# EAGLE design RACOON (EAGLE 9.4.2)
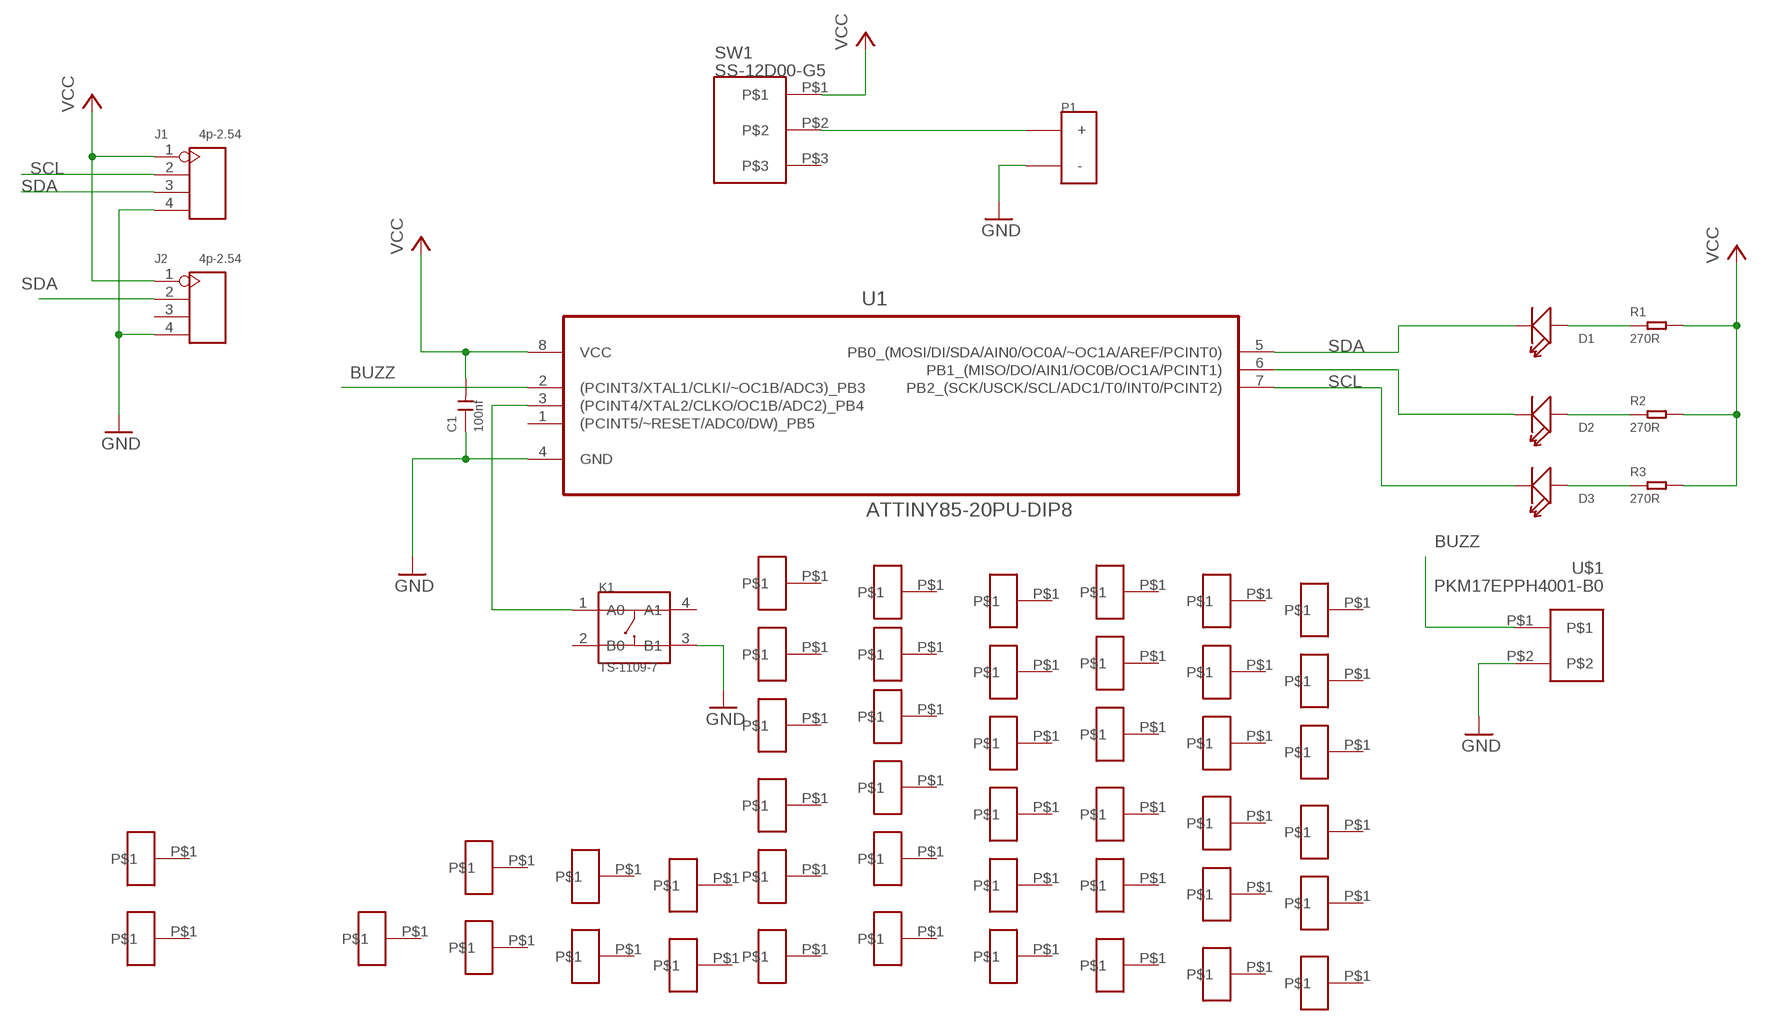
[diagram p0: schematic, sheet 1]

## Parts
C1  100nf  DIP-CERAMIC-DISC-100NF-50V-Y5V(D5.0MM)  [CERAMIC-2.54]
D1  504BW  DIP-LED-BLUE-BLUE(2P-D5MM)  [LED2-2.54-D5.0MM]
D2  504BW  DIP-LED-BLUE-BLUE(2P-D5MM)  [LED2-2.54-D5.0MM]
D3  504BW  DIP-LED-BLUE-BLUE(2P-D5MM)  [LED2-2.54-D5.0MM]
J1  4p-2.54  DIP-BLACK-FEMALE-HEADER-VERT(4P-2.54)  [H4-2.54]
J2  4p-2.54  DIP-BLACK-FEMALE-HEADER-VERT(4P-2.54)  [H4-2.54]
K1  TS-1109-7  DIP-BUTTON-TOP-BLACK(4P-D6.2MM)  [SW4-6.2X6.2X5.0MM]
P1  BATTERY  [BAT_CR2450_TH_BS2450]
R1  270R  DIP-RES-270R-5%-1/4W(PR-D2.3XL6.5MM)  [PR-D2.3XL6.5MM]
R2  270R  DIP-RES-270R-5%-1/4W(PR-D2.3XL6.5MM)  [PR-D2.3XL6.5MM]
R3  270R  DIP-RES-270R-5%-1/4W(PR-D2.3XL6.5MM)  [PR-D2.3XL6.5MM]
SW1  SS-12D00-G5  [SS-12D00-G5]
U1  ATTINY85-20PU-DIP8  MCU-ATTINY85-20PU(DIP8)1  [DIP254P762X533-8]
U$1  PKM17EPPH4001-B0  [PKM17EPPH4001-B0]
U$2  1PIN_HOLE  [1PIN_HOLE]
U$3  1PIN_HOLE  [1PIN_HOLE]
U$4  1PIN_HOLE  [1PIN_HOLE]
U$5  1PIN_HOLE  [1PIN_HOLE]
U$6  1PIN_HOLE  [1PIN_HOLE]
U$7  1PIN_HOLE  [1PIN_HOLE]
U$8  1PIN_HOLE  [1PIN_HOLE]
U$9  1PIN_HOLE  [1PIN_HOLE]
U$10  1PIN_HOLE  [1PIN_HOLE]
U$11  1PIN_HOLE  [1PIN_HOLE]
U$12  1PIN_HOLE  [1PIN_HOLE]
U$13  1PIN_HOLE  [1PIN_HOLE]
U$14  1PIN_HOLE  [1PIN_HOLE]
U$15  1PIN_HOLE  [1PIN_HOLE]
U$16  1PIN_HOLE  [1PIN_HOLE]
U$17  1PIN_HOLE  [1PIN_HOLE]
U$18  1PIN_HOLE  [1PIN_HOLE]
U$19  1PIN_HOLE  [1PIN_HOLE]
U$20  1PIN_HOLE  [1PIN_HOLE]
U$21  1PIN_HOLE  [1PIN_HOLE]
U$22  1PIN_HOLE  [1PIN_HOLE]
U$23  1PIN_HOLE  [1PIN_HOLE]
U$24  1PIN_HOLE  [1PIN_HOLE]
U$25  1PIN_HOLE  [1PIN_HOLE]
U$26  1PIN_HOLE  [1PIN_HOLE]
U$27  1PIN_HOLE  [1PIN_HOLE]
U$28  1PIN_HOLE  [1PIN_HOLE]
U$29  1PIN_HOLE  [1PIN_HOLE]
U$30  1PIN_HOLE  [1PIN_HOLE]
U$31  1PIN_HOLE  [1PIN_HOLE]
U$32  1PIN_HOLE  [1PIN_HOLE]
U$33  1PIN_HOLE  [1PIN_HOLE]
U$34  1PIN_HOLE  [1PIN_HOLE]
U$35  1PIN_HOLE  [1PIN_HOLE]
U$36  1PIN_HOLE  [1PIN_HOLE]
U$37  1PIN_HOLE  [1PIN_HOLE]
U$41  1PIN_HOLE  [1PIN_HOLE]
U$42  1PIN_HOLE  [1PIN_HOLE]
U$43  1PIN_HOLE  [1PIN_HOLE]
U$44  1PIN_HOLE  [1PIN_HOLE]
U$45  1PIN_HOLE  [1PIN_HOLE]
U$46  1PIN_HOLE  [1PIN_HOLE]
U$47  1PIN_HOLE  [1PIN_HOLE]
U$49  1PIN_HOLE  [1PIN_HOLE]
U$50  1PIN_HOLE  [1PIN_HOLE]

## Nets
BUZZ: U1.2((PCINT3/XTAL1/CLKI/~OC1B/ADC3)_PB3) U$1.P$1
GND: C1.1 J1.4 J2.4 K1.3(B1) P1.- U1.4(GND) U$1.P$2
N$1: D1.+ R1.1
N$4: P1.+ SW1.P$2
N$6: D2.+ R2.1
N$7: K1.1(A0) U1.3((PCINT4/XTAL2/CLKO/OC1B/ADC2)_PB4)
N$8: D3.+ R3.1
N$9: D2.- U1.6(PB1_(MISO/DO/AIN1/OC0B/OC1A/PCINT1))
SCL: D3.- J1.2 U1.7(PB2_(SCK/USCK/SCL/ADC1/T0/INT0/PCINT2))
SDA: D1.- J1.3 J2.2 U1.5(PB0_(MOSI/DI/SDA/AIN0/OC0A/~OC1A/AREF/PCINT0))
VCC: C1.2 J1.1 J2.1 R1.2 R2.2 R3.2 SW1.P$1 U1.8(VCC)
Unconnected: J2.3 K1.2(B0) K1.4(A1) SW1.P$3 U1.1((PCINT5/~RESET/ADC0/DW)_PB5) U$2.P$1 U$3.P$1 U$4.P$1 U$5.P$1 U$6.P$1 U$7.P$1 U$8.P$1 U$9.P$1 U$10.P$1 U$11.P$1 U$12.P$1 U$13.P$1 U$14.P$1 U$15.P$1 U$16.P$1 U$17.P$1 U$18.P$1 U$19.P$1 U$20.P$1 U$21.P$1 U$22.P$1 U$23.P$1 U$24.P$1 U$25.P$1 U$26.P$1 U$27.P$1 U$28.P$1 U$29.P$1 U$30.P$1 U$31.P$1 U$32.P$1 U$33.P$1 U$34.P$1 U$35.P$1 U$36.P$1 U$37.P$1 U$41.P$1 U$42.P$1 U$43.P$1 U$44.P$1 U$45.P$1 U$46.P$1 U$47.P$1 U$49.P$1 U$50.P$1

## Library data of the parts
C1 = Seeed-OPL-Capacitor:DIP-CERAMIC-DISC-100NF-50V-Y5V(D5.0MM): 302010208; MPN: CC1-F5SL2A101KSPW
D1-D3 = Seeed-LED:DIP-LED-BLUE-BLUE(2P-D5MM): 304090062; MPN: 504BW
J1 J2 = Seeed-OPL-Connector:DIP-BLACK-FEMALE-HEADER-VERT(4P-2.54): 320030017; MPN: F185-1104A1BSYA1
K1 = Seeed-OPL-Switch:DIP-BUTTON-TOP-BLACK(4P-D6.2MM): 311020032; MPN: TS-1109-7
P1 = akita:BATTERY
R1-R3 = Seeed-OPL-Resistor:DIP-RES-270R-5%-1/4W(PR-D2.3XL6.5MM): 301020068; MPN: FHCFR-1/4W-271J
SW1 = SamacSys_Parts:SS-12D00-G5
U1 = Seeed-OPL-ic:MCU-ATTINY85-20PU(DIP8): 310010112; MPN: ATTINY85-20PU
U$1 = SamacSys_Parts:PKM17EPPH4001-B0
U$2-U$37 U$41-U$47 U$49 U$50 = akita:1PIN_HOLE

## Board
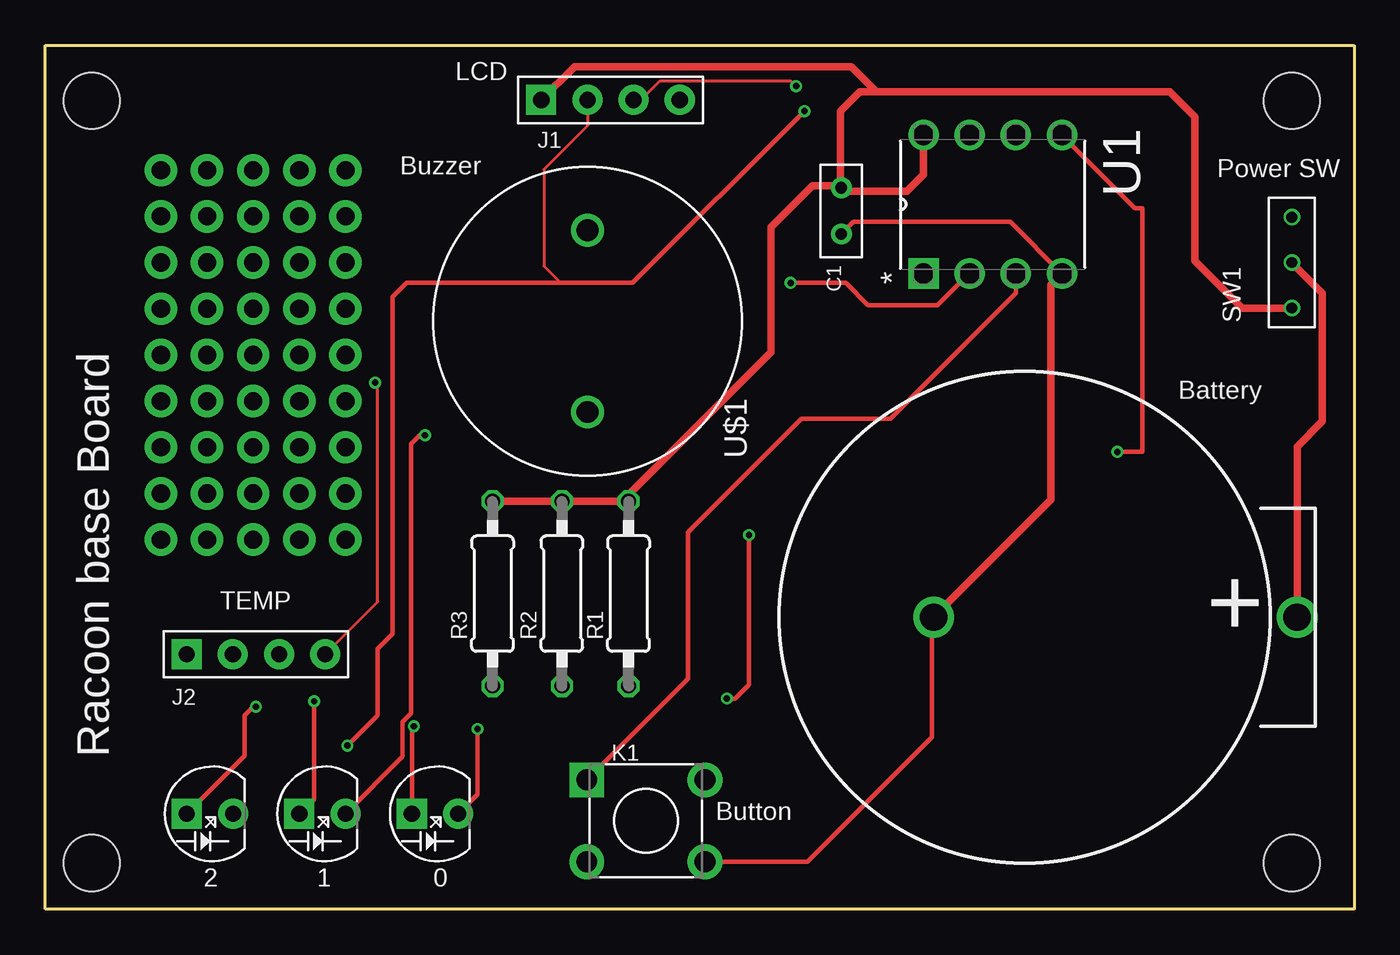
[diagram p1: board, top side]
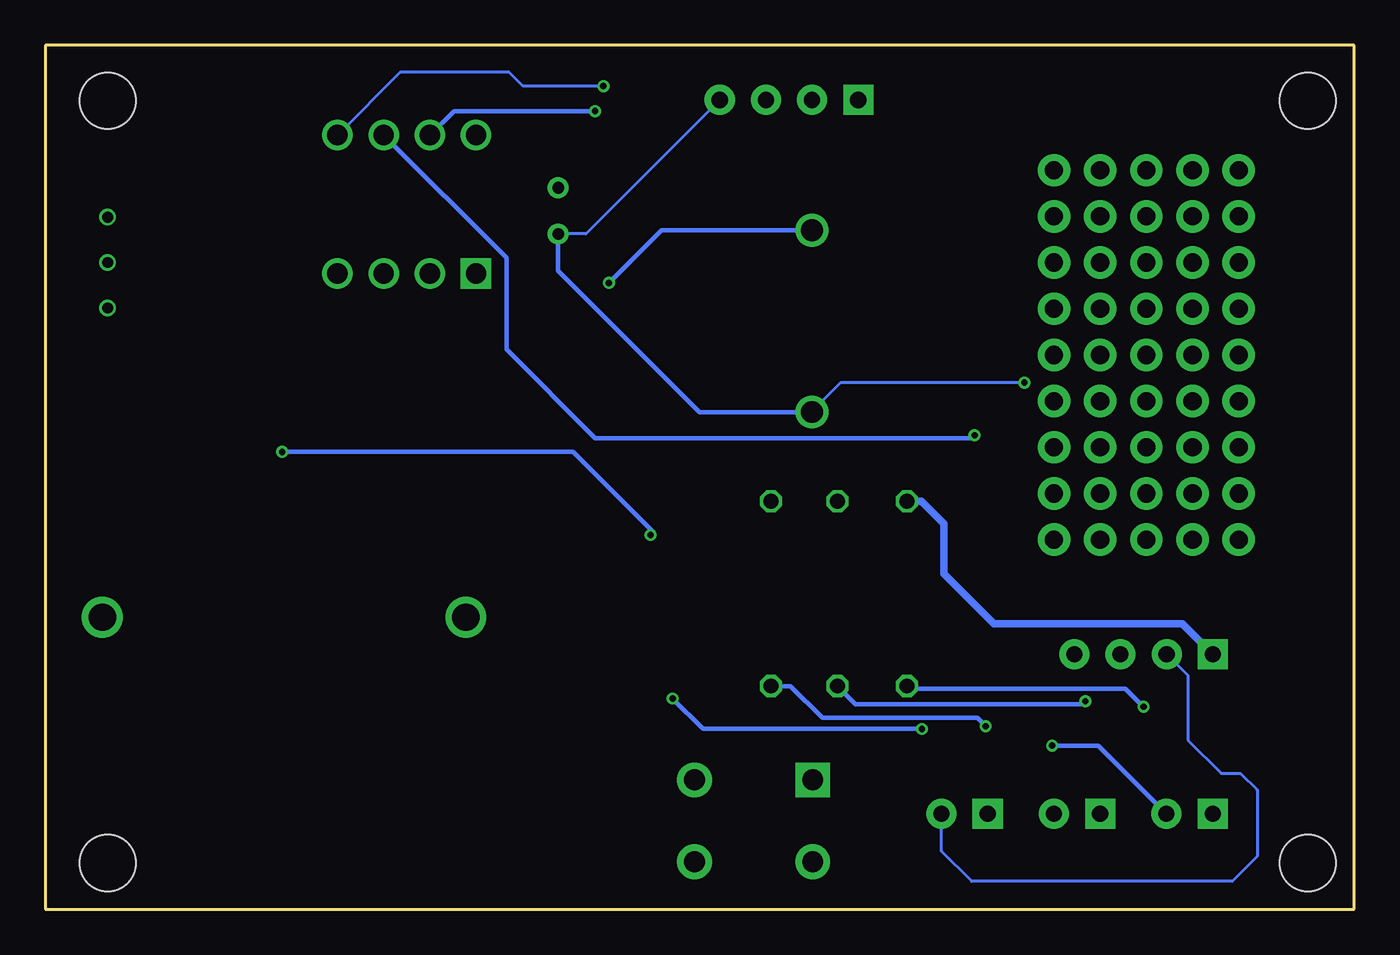
[diagram p2: board, bottom side, seen from below]

Size 72 x 47.5 mm. Coordinates in mm from the lower left corner, seen from the top.
Outline: 0,0 0,47.5 72,47.5 72,0 0,0
Copper layers (1*16): Top 0.035mm / dielectric 1.6mm / Bottom 0.035mm
Design rules "Elecrow_2-layer_PCB_eagle_rule": minimum track width 6mil, minimum drill 12mil, track to track 6mil, track to pad 6mil, pad to pad 6mil, via to via 8mil, smd to smd 0mil, copper to edge 20mil, drill to drill 10mil, minimum pad ring 6mil, minimum via ring 6mil, stop-mask expansion 0mil, vias tented up to drill 100mil, thermal gap 10mil
Holes 3.1 mm at 2.54,44.45 2.54,2.54 68.58,2.54 68.58,44.45

### Footprints (pad centres in the part's own frame; a part is rotated, then mirrored left to right if it is on the bottom)
CERAMIC-2.54 = drill 0.635 pad 1.143: 1 -1.27,0; 2 1.27,0
LED2-2.54-D5.0MM = drill 0.889 pad 1.651 square: + -1.27,0 | drill 0.889 pad 1.651: - 1.27,0
H4-2.54 = drill 0.889 pad 1.651 square: 1 0,3.81 | drill 0.889 pad 1.651: 2 0,1.27; 3 0,-1.27; 4 0,-3.81
SW4-6.2X6.2X5.0MM = drill 1.143 pad 1.905 square: 1 -3.25,2.25 | drill 1.143 pad 1.905: 2 -3.25,-2.25; 3 3.25,-2.25; 4 3.25,2.25
BAT_CR2450_TH_BS2450 = drill 1.5: + 20,0; - 0,0
PR-D2.3XL6.5MM = drill 0.813 octagon: 1 -4.953,0; 2 5.207,0
SS-12D00-G5 = drill 0.6: P$1 -2.5,0; P$2 0,0; P$3 2.5,0
DIP254P762X533-8 = drill 1.118 square: 1 -7.62,7.62 | drill 1.118: 2 -7.62,5.08; 3 -7.62,2.54; 4 -7.62,0; 5 0,0; 6 0,2.54; 7 0,5.08; 8 0,7.62
PKM17EPPH4001-B0 = drill 1.2: P$1 5,0; P$2 -5,0
1PIN_HOLE = drill 1 pad 1.778: P$1 0,0

### Placement (x,y rotation side)
C1  43.79,38.4 90 top
D1  21.43,5.24 0 top
D2  15.24,5.24 0 top
D3  9.05,5.24 0 top
J1  31.09,44.5 90 top
J2  11.58,14.02 90 top
K1  33.04,4.86 0 top
P1  48.87,16.05 0 top
R1  32.08,17.22 90 top
R2  28.42,17.22 90 top
R3  24.6,17.22 90 top
SW1  68.58,35.56 90 top
U1  55.93,42.57 90 top
U$1  29.83,32.34 90 top
U$2  13.97,40.64 0 top
U$3  13.97,38.1 0 top
U$4  13.97,35.56 0 top
U$5  13.97,33.02 0 top
U$6  13.97,30.48 0 top
U$7  13.97,27.94 0 top
U$8  13.97,25.4 0 top
U$9  13.97,22.86 0 top
U$10  13.97,20.32 0 top
U$11  11.43,20.32 0 top
U$12  11.43,22.86 0 top
U$13  11.43,25.4 0 top
U$14  11.43,27.94 0 top
U$15  11.43,30.48 0 top
U$16  11.43,33.02 0 top
U$17  11.43,35.56 0 top
U$18  11.43,38.1 0 top
U$19  11.43,40.64 0 top
U$20  6.35,40.64 0 top
U$21  8.89,40.64 0 top
U$22  6.35,38.1 0 top
U$23  8.89,38.1 0 top
U$24  6.35,35.56 0 top
U$25  8.89,35.56 0 top
U$26  6.35,33.02 0 top
U$27  8.89,33.02 0 top
U$28  6.35,30.48 0 top
U$29  8.89,30.48 0 top
U$30  6.35,27.94 0 top
U$31  8.89,27.94 0 top
U$32  6.35,25.4 0 top
U$33  8.89,25.4 0 top
U$34  6.35,22.86 0 top
U$35  8.89,22.86 0 top
U$36  6.35,20.32 0 top
U$37  8.89,20.32 0 top
U$41  16.51,20.32 0 top
U$42  16.51,22.86 0 top
U$43  16.51,30.48 0 top
U$44  16.51,27.94 0 top
U$45  16.51,25.4 0 top
U$46  16.51,33.02 0 top
U$47  16.51,38.1 0 top
U$49  16.51,35.56 0 top
U$50  16.51,40.64 0 top

### Tracks (layer width: path | path; a pad name or v marks a point on that pad's centre or on a via)
BUZZ  (via drill 0.35)
  Top 0.254: v41,34.44 44.04,34.44 45.26,33.22 49.07,33.22 50.8,34.95 U1.2
  Bottom 0.254: U$1.P$1 38.1,37.34 v41,34.44
GND  (via drill 0.35)
  Top 0.152: J2.4 18.29,16.92 18.29,28.8 v18.14,28.96
  Top 0.254: C1.1 44.45,37.8 53.09,37.8 U1.4 | K1.3 41.93,2.61 48.77,9.45 48.77,15.95 49.25,16.43
  Top 0.406: P1.- 49.25,16.43 55.32,22.5 55.32,34.34 U1.4
  Bottom 0.152: J1.4 42.27,37.13 C1.1 | v18.14,28.96 28.25,28.96 29.87,27.34
  Bottom 0.254: U$1.P$2 29.87,27.34 36.02,27.34 43.79,35.1 C1.1
N$1  (via drill 0.35)
  Top 0.254: D1.+ 20.16,9.95 v20.27,10.06
  Bottom 0.254: v20.27,10.06 20.73,10.52 29.26,10.52 31.01,12.27 R1.1
N$4
  Top 0.406: P1.+ 68.87,25.44 70.26,26.82 70.26,33.88 SW1.P$2
N$6  (via drill 0.35)
  Top 0.254: D2.+ 14.78,6.05 v14.78,11.43
  Bottom 0.254: R2.1 27.43,11.28 14.94,11.28 v14.78,11.43
N$7
  Top 0.254: K1.1 35.36,12.68 35.36,20.73 41.6,26.98 46.48,26.98 53.39,33.88 U1.3
N$8  (via drill 0.35)
  Top 0.254: D3.+ 10.97,8.43 10.97,10.67 11.43,11.12 v11.58,11.12
  Bottom 0.254: v11.58,11.12 12.57,12.12 24.45,12.12 R3.1
N$9  (via drill 0.35)
  Top 0.254: D2.- 19.66,8.39 19.66,10.31 20.12,10.76 20.12,25.6 20.57,26.06 v20.88,26.06
  Bottom 0.254: v20.88,26.06 21.03,25.91 41.76,25.91 46.63,30.79 46.63,35.81 U1.6
SCL  (via drill 0.35)
  Top 0.152: J1.2 29.82,43.08 27.43,40.69 27.43,35.36 28.35,34.44
  Top 0.254: v16.61,8.99 18.29,10.67 18.29,14.33 19.1,15.14 19.1,33.67 19.87,34.44 28.35,34.44 32.31,34.44 v41.76,43.89
  Bottom 0.254: D3.- 14.07,8.99 v16.61,8.99 | v41.76,43.89 49.53,43.89 U1.7
SDA  (via drill 0.35)
  Top 0.152: J1.3 32.77,44.5 33.82,45.55 41.01,45.55 v41.3,45.26
  Top 0.254: U1.5 59.94,38.56 60.35,38.56 60.35,25.15 v58.98,25.15 | v38.71,20.57 38.71,12.34 37.95,11.58 v37.49,11.58 | v23.77,9.91 23.77,6.32 D1.-
  Bottom 0.152: v41.3,45.26 45.72,45.26 46.48,46.02 52.48,46.02 U1.5 | J2.2 9.14,12.85 9.14,9.3 7.32,7.47 6.25,7.47 5.33,6.55 5.33,2.9 6.71,1.52 21.03,1.52 22.7,3.19 D1.-
  Bottom 0.254: v58.98,25.15 42.98,25.15 38.56,20.73 v38.71,20.57 | v37.49,11.58 35.81,9.91 v23.77,9.91
VCC
  Top 0.406: SW1.P$1 65.85,33.06 63.25,35.66 63.25,43.59 61.87,44.96 45.72,44.96 | 43.74,39.78 43.74,43.89 44.81,44.96 45.72,44.96 | 43.74,39.78 43.74,39.73 C1.2 43.99,39.47 47.4,39.47 48.31,40.39 U1.8 | R3.2 R2.2 R1.2 32.08,22.79 39.93,30.63 39.93,37.49 42.22,39.78 43.74,39.78 | 45.72,44.96 44.35,46.33 29.11,46.33 J1.1
  Bottom 0.406: J2.1 9.45,15.7 19.81,15.7 22.55,18.44 22.55,21.18 23.8,22.43 R3.2

### Text on the board
tNames: LCD | Buzzer | Power SW | Battery | base Board | TEMP | Racoon | Button | 2 | 1 | 0